# EAGLE schematic Trainiiii_Cape (EAGLE 9.6.0)

## Sheet 1 of 4
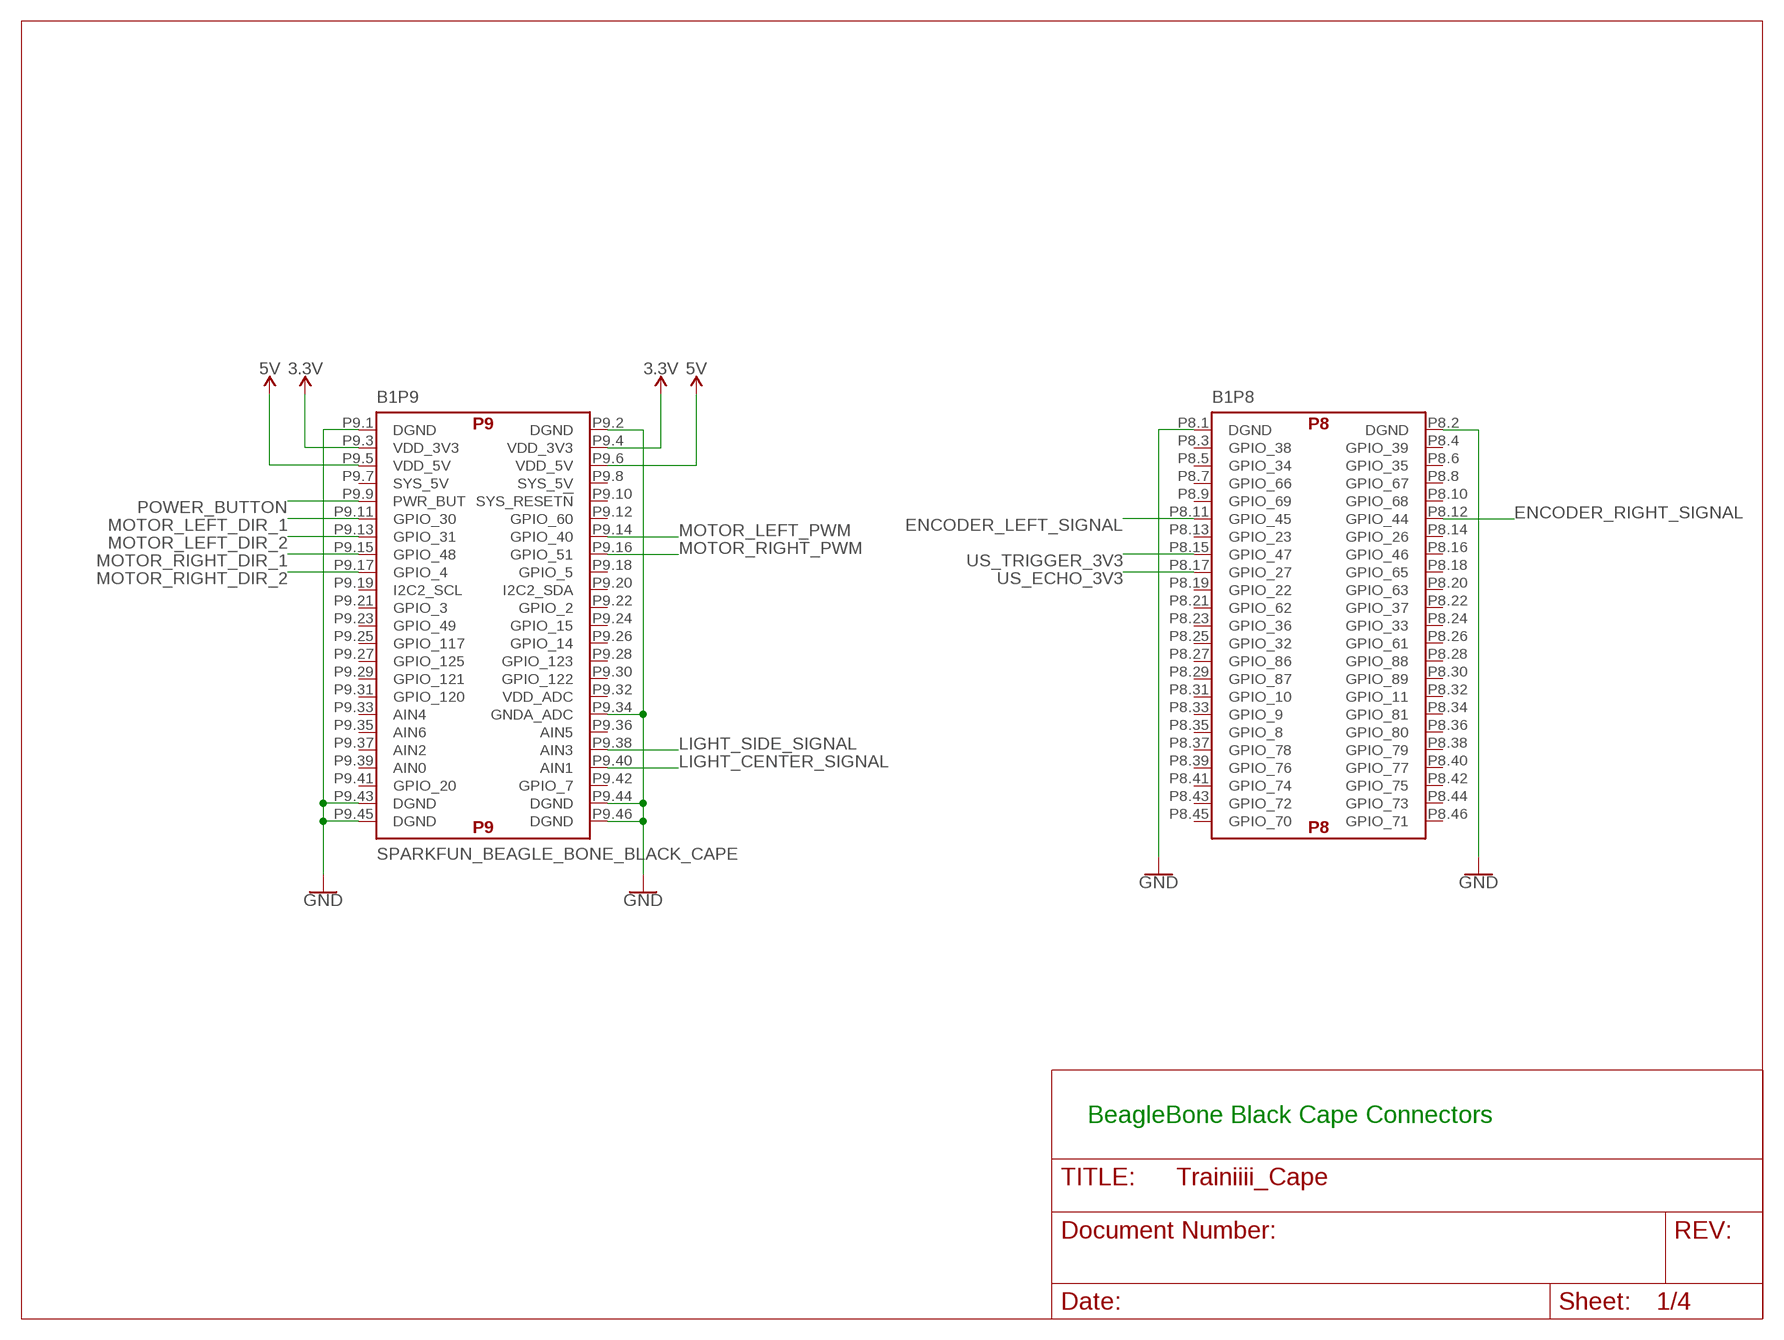
[diagram p0: schematic, sheet 1]

### Parts
B1  SPARKFUN_BEAGLE_BONE_BLACK_CAPE  [BEAGLE_BONE_BLACK_CAPE]

### Nets
3.3V: B1.P9.3(P9:VDD_3V3) B1.P9.4(P9:VDD_3V3) ; also sheet 2,3
5V: B1.P9.5(P9:VDD_5V) B1.P9.6(P9:VDD_5V) ; also sheet 3
ENCODER_LEFT_SIGNAL: B1.P8.11(P8:GPIO_45) ; also sheet 3
ENCODER_RIGHT_SIGNAL: B1.P8.12(P8:GPIO_44) ; also sheet 3
GND: B1.P8.1(P8:DGND) B1.P8.2(P8:DGND) B1.P9.1(P9:DGND) B1.P9.2(P9:DGND) B1.P9.34(P9:GNDA_ADC) B1.P9.43(P9:DGND) B1.P9.44(P9:DGND) B1.P9.45(P9:DGND) B1.P9.46(P9:DGND) ; also sheet 2,3,4
LIGHT_CENTER_SIGNAL: B1.P9.40(P9:AIN1) ; also sheet 3
LIGHT_SIDE_SIGNAL: B1.P9.38(P9:AIN3) ; also sheet 3
MOTOR_LEFT_DIR_1: B1.P9.11(P9:GPIO_30) ; also sheet 2
MOTOR_LEFT_DIR_2: B1.P9.13(P9:GPIO_31) ; also sheet 2
MOTOR_LEFT_PWM: B1.P9.14(P9:GPIO_40) ; also sheet 2
MOTOR_RIGHT_DIR_1: B1.P9.15(P9:GPIO_48) ; also sheet 2
MOTOR_RIGHT_DIR_2: B1.P9.17(P9:GPIO_4) ; also sheet 2
MOTOR_RIGHT_PWM: B1.P9.16(P9:GPIO_51) ; also sheet 2
POWER_BUTTON: B1.P9.9(P9:PWR_BUT) ; also sheet 4
US_ECHO_3V3: B1.P8.17(P8:GPIO_27) ; also sheet 3
US_TRIGGER_3V3: B1.P8.15(P8:GPIO_47) ; also sheet 3
Unconnected: B1.P8.3(P8:GPIO_38) B1.P8.4(P8:GPIO_39) B1.P8.5(P8:GPIO_34) B1.P8.6(P8:GPIO_35) B1.P8.7(P8:GPIO_66) B1.P8.8(P8:GPIO_67) B1.P8.9(P8:GPIO_69) B1.P8.10(P8:GPIO_68) B1.P8.13(P8:GPIO_23) B1.P8.14(P8:GPIO_26) B1.P8.16(P8:GPIO_46) B1.P8.18(P8:GPIO_65) B1.P8.19(P8:GPIO_22) B1.P8.20(P8:GPIO_63) B1.P8.21(P8:GPIO_62) B1.P8.22(P8:GPIO_37) B1.P8.23(P8:GPIO_36) B1.P8.24(P8:GPIO_33) B1.P8.25(P8:GPIO_32) B1.P8.26(P8:GPIO_61) B1.P8.27(P8:GPIO_86) B1.P8.28(P8:GPIO_88) B1.P8.29(P8:GPIO_87) B1.P8.30(P8:GPIO_89) B1.P8.31(P8:GPIO_10) B1.P8.32(P8:GPIO_11) B1.P8.33(P8:GPIO_9) B1.P8.34(P8:GPIO_81) B1.P8.35(P8:GPIO_8) B1.P8.36(P8:GPIO_80) B1.P8.37(P8:GPIO_78) B1.P8.38(P8:GPIO_79) B1.P8.39(P8:GPIO_76) B1.P8.40(P8:GPIO_77) B1.P8.41(P8:GPIO_74) B1.P8.42(P8:GPIO_75) B1.P8.43(P8:GPIO_72) B1.P8.44(P8:GPIO_73) B1.P8.45(P8:GPIO_70) B1.P8.46(P8:GPIO_71) B1.P9.7(P9:SYS_5V) B1.P9.8(P9:SYS_5V) B1.P9.10(P9:SYS_RESET!N) B1.P9.12(P9:GPIO_60) B1.P9.18(P9:GPIO_5) B1.P9.19(P9:I2C2_SCL) B1.P9.20(P9:I2C2_SDA) B1.P9.21(P9:GPIO_3) B1.P9.22(P9:GPIO_2) B1.P9.23(P9:GPIO_49) B1.P9.24(P9:GPIO_15) B1.P9.25(P9:GPIO_117) B1.P9.26(P9:GPIO_14) B1.P9.27(P9:GPIO_125) B1.P9.28(P9:GPIO_123) B1.P9.29(P9:GPIO_121) B1.P9.30(P9:GPIO_122) B1.P9.31(P9:GPIO_120) B1.P9.32(P9:VDD_ADC) B1.P9.33(P9:AIN4) B1.P9.35(P9:AIN6) B1.P9.36(P9:AIN5) B1.P9.37(P9:AIN2) B1.P9.39(P9:AIN0) B1.P9.41(P9:GPIO_20) B1.P9.42(P9:GPIO_7)

### Notes on the sheet
- BeagleBone Black Cape Connectors

## Sheet 2 of 4
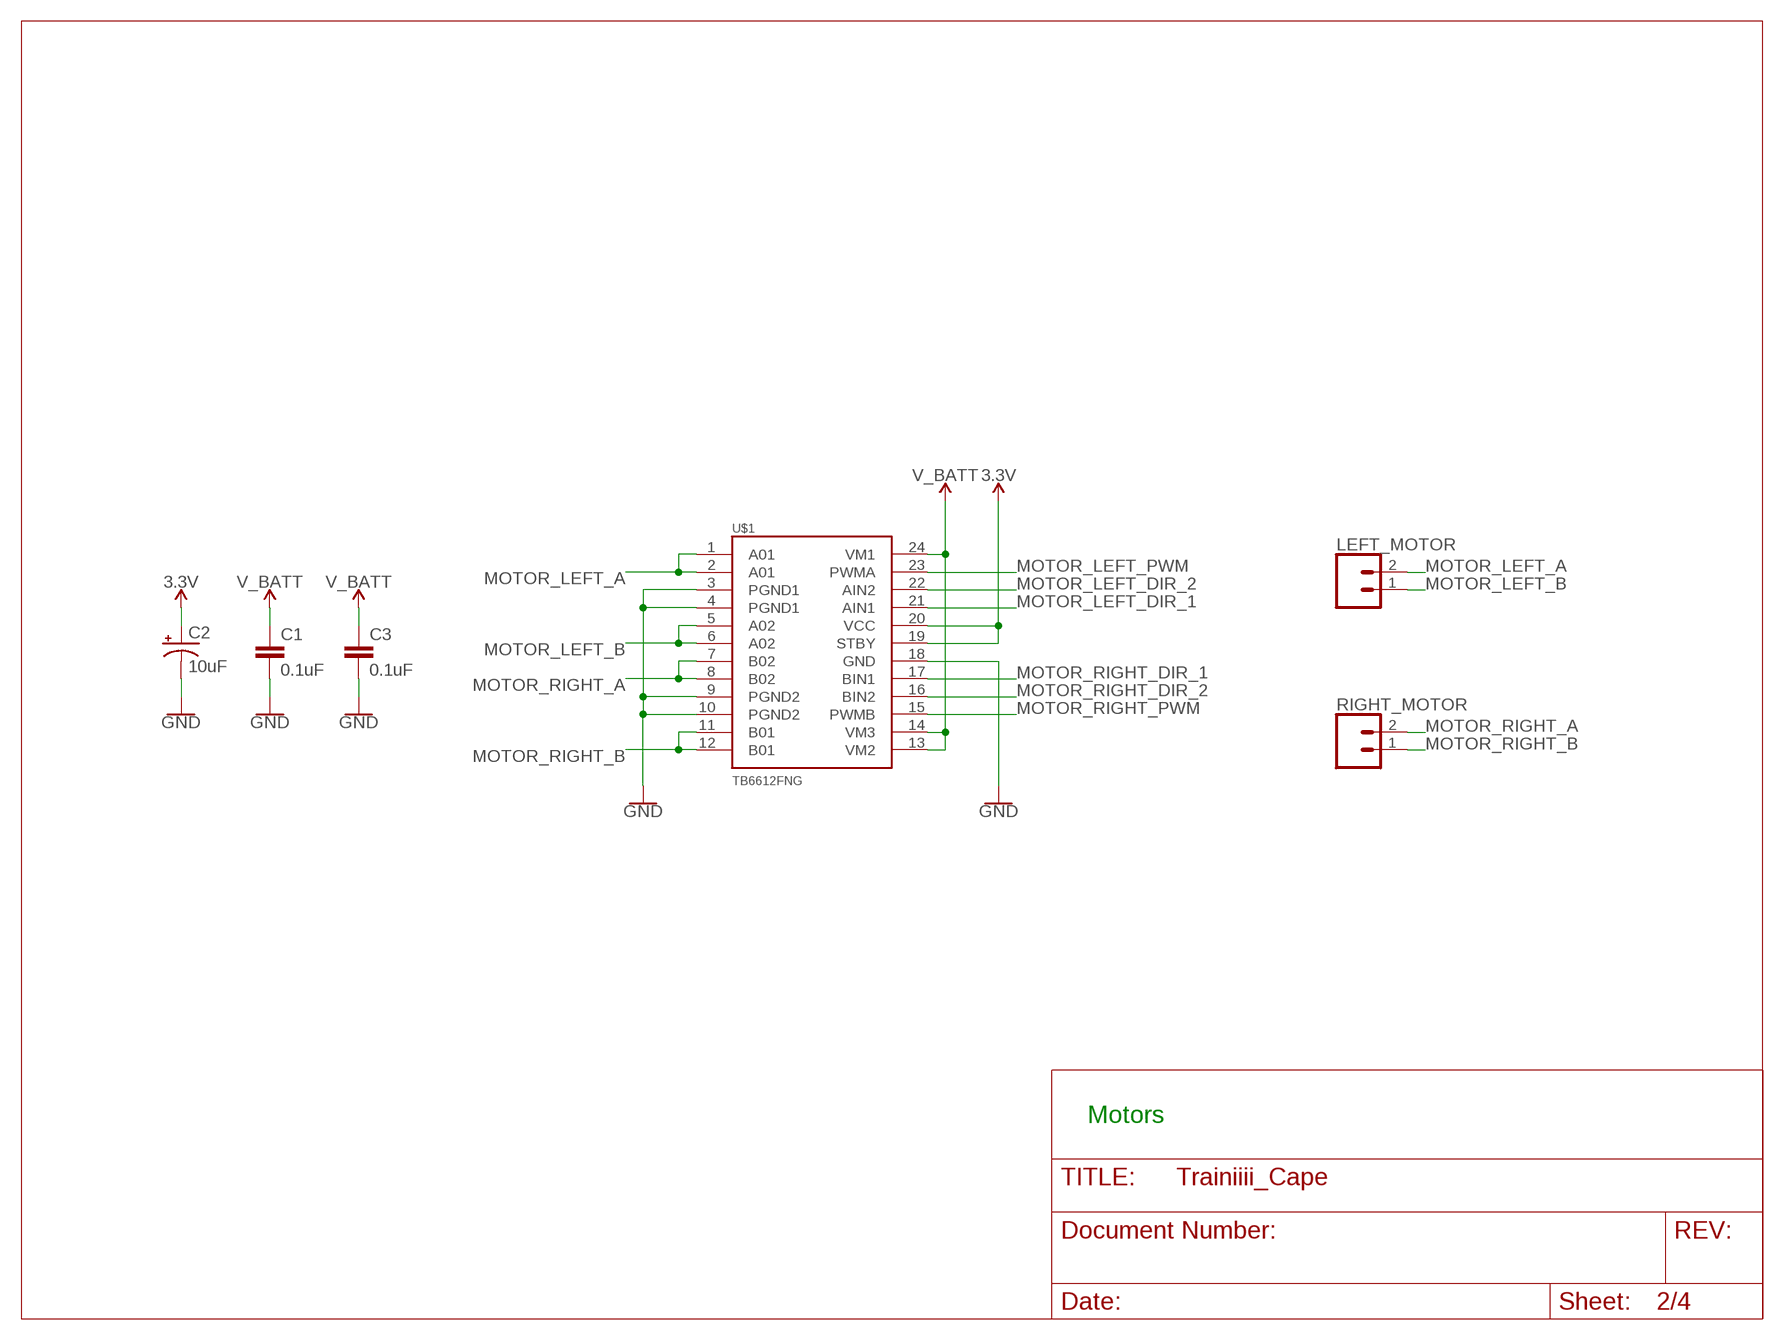
[diagram p1: schematic, sheet 2]

### Parts
C1  0.1uF  0.1UF-0402-16V-10%  [0402]
C2  10uF  10UF-POLAR-EIA3528-20V-10%(TANT)  [EIA3528]
C3  0.1uF  0.1UF-0402-16V-10%  [0402]
LEFT_MOTOR  CONN_02  [1X02]
RIGHT_MOTOR  CONN_02  [1X02]
U$1  TB6612FNG  [SSOP24]

### Nets
3.3V: C2.A(+) U$1.19(STBY) U$1.20(VCC) ; also sheet 1,3
GND: C1.2 C2.C(-) C3.2 U$1.3(PGND1) U$1.4(PGND1) U$1.9(PGND2) U$1.10(PGND2) U$1.18(GND) ; also sheet 1,3,4
MOTOR_LEFT_A: LEFT_MOTOR.2 U$1.1(A01) U$1.2(A01)
MOTOR_LEFT_B: LEFT_MOTOR.1 U$1.5(A02) U$1.6(A02)
MOTOR_LEFT_DIR_1: U$1.21(AIN1) ; also sheet 1
MOTOR_LEFT_DIR_2: U$1.22(AIN2) ; also sheet 1
MOTOR_LEFT_PWM: U$1.23(PWMA) ; also sheet 1
MOTOR_RIGHT_A: RIGHT_MOTOR.2 U$1.7(B02) U$1.8(B02)
MOTOR_RIGHT_B: RIGHT_MOTOR.1 U$1.11(B01) U$1.12(B01)
MOTOR_RIGHT_DIR_1: U$1.17(BIN1) ; also sheet 1
MOTOR_RIGHT_DIR_2: U$1.16(BIN2) ; also sheet 1
MOTOR_RIGHT_PWM: U$1.15(PWMB) ; also sheet 1
V_BATT: C1.1 C3.1 U$1.13(VM2) U$1.14(VM3) U$1.24(VM1) ; also sheet 4

### Notes on the sheet
- Motors

## Sheet 3 of 4
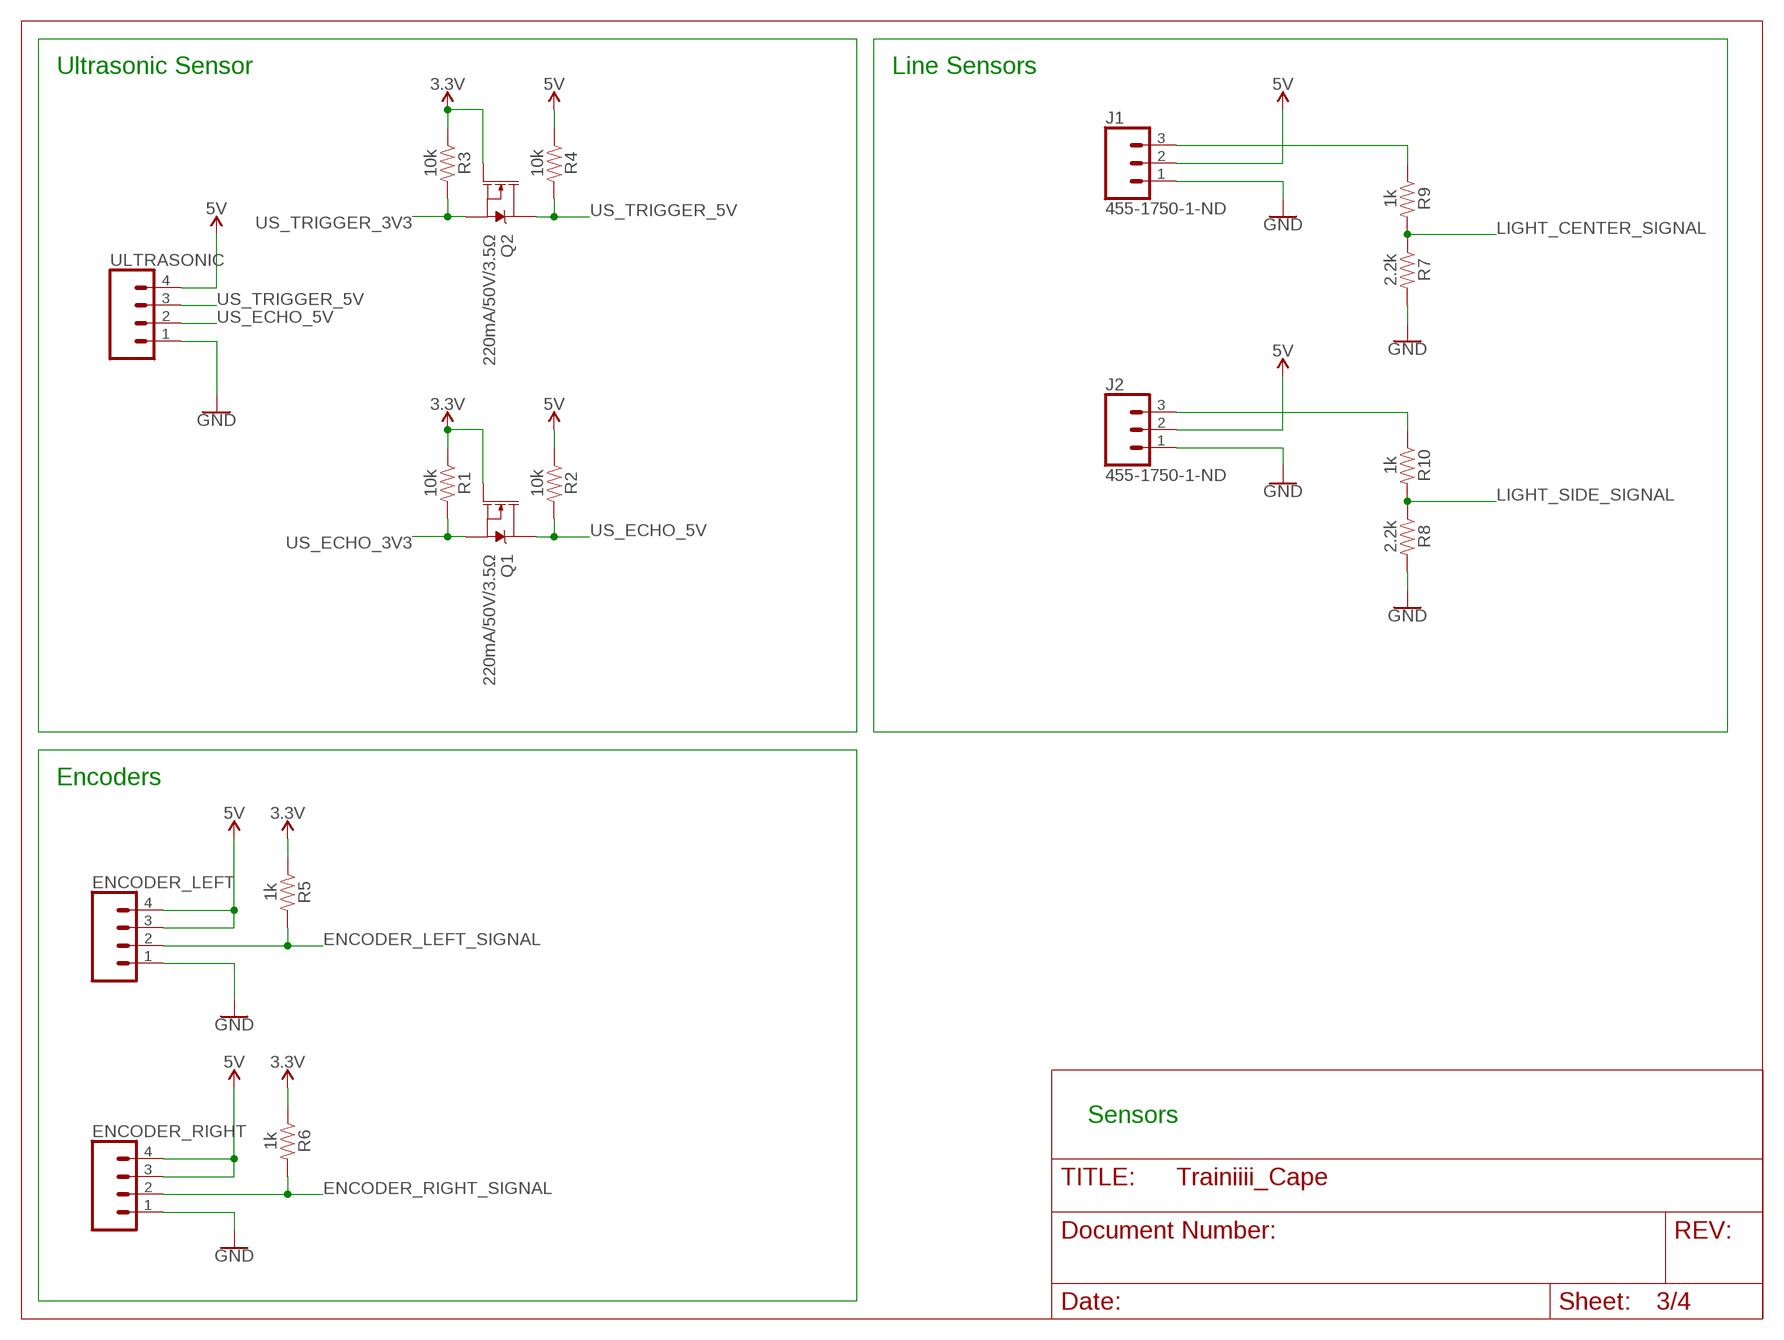
[diagram p2: schematic, sheet 3]

### Parts
ENCODER_LEFT  CONN_04PTH  [1X04]
ENCODER_RIGHT  CONN_04PTH  [1X04]
J1  455-1750-1-ND  CONN_03  [1X03]
J2  455-1750-1-ND  CONN_03  [1X03]
Q1  220mA/50V/3.5Ω  MOSFET-NCH-BSS138  [SOT23-3]
Q2  220mA/50V/3.5Ω  MOSFET-NCH-BSS138  [SOT23-3]
R1  10k  10KOHM-0603-1/10W-1%  [0603]
R2  10k  10KOHM-0603-1/10W-1%  [0603]
R3  10k  10KOHM-0603-1/10W-1%  [0603]
R4  10k  10KOHM-0603-1/10W-1%  [0603]
R5  1k  1KOHM-0603-1/10W-1%  [0603]
R6  1k  1KOHM-0603-1/10W-1%  [0603]
R7  2.2k  2.2KOHM-0603-1/10W-1%  [0603]
R8  2.2k  2.2KOHM-0603-1/10W-1%  [0603]
R9  1k  1KOHM-0603-1/10W-1%  [0603]
R10  1k  1KOHM-0603-1/10W-1%  [0603]
ULTRASONIC  CONN_04PTH  [1X04]

### Nets
3.3V: Q1.1(G) Q2.1(G) R1.1 R3.1 R5.1 R6.1 ; also sheet 1,2
5V: ENCODER_LEFT.3 ENCODER_LEFT.4 ENCODER_RIGHT.3 ENCODER_RIGHT.4 J1.2 J2.2 R2.1 R4.1 ULTRASONIC.4 ; also sheet 1
ENCODER_LEFT_SIGNAL: ENCODER_LEFT.2 R5.2 ; also sheet 1
ENCODER_RIGHT_SIGNAL: ENCODER_RIGHT.2 R6.2 ; also sheet 1
GND: ENCODER_LEFT.1 ENCODER_RIGHT.1 J1.1 J2.1 R7.2 R8.2 ULTRASONIC.1 ; also sheet 1,2,4
LIGHT_CENTER_SIGNAL: R7.1 R9.2 ; also sheet 1
LIGHT_SIDE_SIGNAL: R8.1 R10.2 ; also sheet 1
N$7: J2.3 R10.1
N$8: J1.3 R9.1
US_ECHO_3V3: Q1.2(S) R1.2 ; also sheet 1
US_ECHO_5V: Q1.3(D) R2.2 ULTRASONIC.2
US_TRIGGER_3V3: Q2.2(S) R3.2 ; also sheet 1
US_TRIGGER_5V: Q2.3(D) R4.2 ULTRASONIC.3

### Notes on the sheet
- Ultrasonic Sensor | Line Sensors
- Encoders
- Sensors

## Sheet 4 of 4
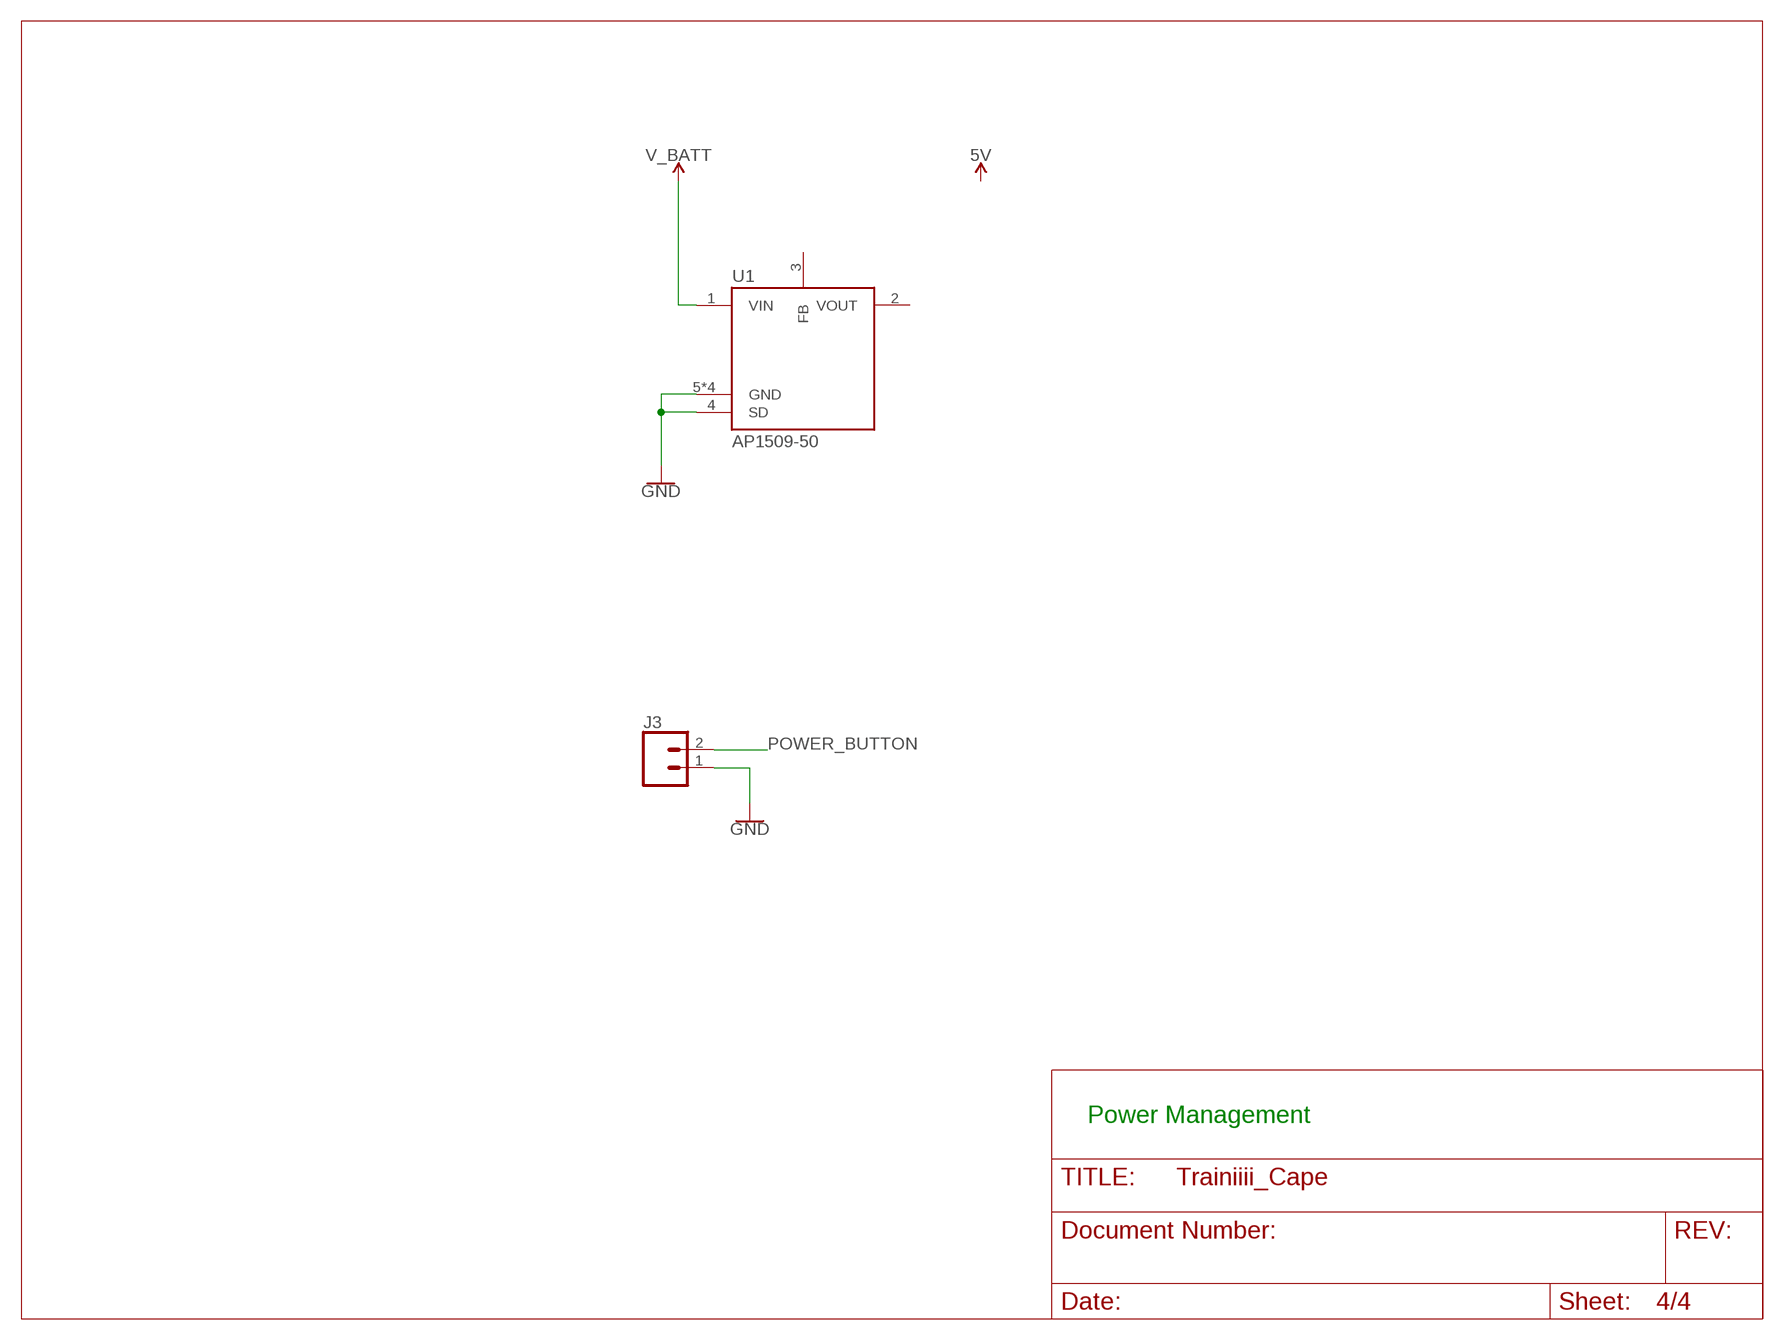
[diagram p3: schematic, sheet 4]

### Parts
J3  CONN_02  [1X02]
U1  AP1509-50  [SOIC-8]

### Nets
GND: J3.1 U1.4(SD) U1.5(GND) U1.6(GND) U1.7(GND) U1.8(GND) ; also sheet 1,2,3
POWER_BUTTON: J3.2 ; also sheet 1
V_BATT: U1.1(VIN) ; also sheet 2
Unconnected: U1.2(VOUT) U1.3(FB)

### Notes on the sheet
- Power Management

## Library data of the parts
B1 = SparkFun-Boards:SPARKFUN_BEAGLE_BONE_BLACK_CAPE: BeagleBone Black Rev C Cape Generic footprint for BeagleBone Black Rev C Capes. SparkFun Products: SparkFun BeagleBone Black Proto Cape <https://www.sparkfun.com/products/12774> SparkFun CryptoCape <https://www.sparkfun.com/products/12773>
C1 C3 = SparkFun-Capacitors:0.1UF: 0.1µF ceramic capacitors A capacitor is a passive two-terminal electrical component used to store electrical energy temporarily in an electric field.; PROD_ID: CAP-12416
C2 = SparkFun-Capacitors:10UF-POLAR: 10.0µF polarized capacitors A capacitor is a passive two-terminal electrical component used to store electrical energy temporarily in an electric field.; PROD_ID: CAP-08063
ENCODER_LEFT ENCODER_RIGHT ULTRASONIC = SparkFun-Connectors:CONN_04: Multi connection point. Often used as Generic Header-pin footprint for 0.1 inch spaced/style header connections On any of the 0.1 inch spaced packages, you can populate with these: Break Away Headers - Straight <https://www.sparkfun.com/products/116> (PRT-00116) Break Away Male Headers - Right Angle <https://www.sparkfun.com/products/553> (PRT-00553) Female Headers <https://www.sparkfun.com/products/115> (PRT-00115) Break Away Headers - Machine Pin <https://www.sparkfun.com/products/117> (PRT-00117) Break Away Female Headers - Swiss Machine Pin <https://www.sparkfun.com/products/743> (PRT-00743) For SCREWTERMINALS and SPRING TERMINALS visit here: Screw Terimnals on SparkFun.com <https://www.sparkfun.com/search/results?term=Screw+Terminals> (5mm/3.5mm/2.54mm spacing) This device is also useful as a general connection point to wire up your design to another part of your project. Our various solder wires solder well into these plated through hole pads. Hook-Up Wire - Assortment (Stranded, 22 AWG) <https://www.sparkfun.com/products/11375> (PRT-11375) Hook-Up Wire - Assortment (Solid Core, 22 AWG) <https://www.sparkfun.com/products/11367> (PRT-11367) View the entire wire category on our website here <https://www.sparkfun.com/categories/141> Special notes: Molex polarized connector foot print use with SKU : PRT-08231 with associated crimp pins and housings. 1MM SMD Version SKU: PRT-10208; PROD_ID: CONN-09696
J1 J2 = SparkFun-Connectors:CONN_03: Multi connection point. Often used as Generic Header-pin footprint for 0.1 inch spaced/style header connections On any of the 0.1 inch spaced packages, you can populate with these: Break Away Headers - Straight <https://www.sparkfun.com/products/116> (PRT-00116) Break Away Male Headers - Right Angle <https://www.sparkfun.com/products/553> (PRT-00553) Female Headers <https://www.sparkfun.com/products/115> (PRT-00115) Break Away Headers - Machine Pin <https://www.sparkfun.com/products/117> (PRT-00117) Break Away Female Headers - Swiss Machine Pin <https://www.sparkfun.com/products/743> (PRT-00743) Stackable Header - 3 Pin (Female, 0.1") <https://www.sparkfun.com/products/13875> (PRT-13875) For SCREWTERMINALS and SPRING TERMINALS visit here: Screw Terimnals on SparkFun.com <https://www.sparkfun.com/search/results?term=Screw+Terminals> (5mm/3.5mm/2.54mm spacing) This device is also useful as a general connection point to wire up your design to another part of your project. Our various solder wires solder well into these plated through hole pads. Hook-Up Wire - Assortment (Stranded, 22 AWG) <https://www.sparkfun.com/products/11375> (PRT-11375) Hook-Up Wire - Assortment (Solid Core, 22 AWG) <https://www.sparkfun.com/products/11367> (PRT-11367) View the entire wire category on our website here <https://www.sparkfun.com/categories/141> Special notes: Molex polarized connector foot print use with SKU : PRT-08232 with associated crimp pins and housings.; PROD_ID: XXX-00000
J3 LEFT_MOTOR RIGHT_MOTOR = SparkFun-Connectors:CONN_02: Multi connection point. Often used as Generic Header-pin footprint for 0.1 inch spaced/style header connections On any of the 0.1 inch spaced packages, you can populate with these: Break Away Headers - Straight <https://www.sparkfun.com/products/116> (PRT-00116) Break Away Male Headers - Right Angle <https://www.sparkfun.com/products/553> (PRT-00553) Female Headers <https://www.sparkfun.com/products/115> (PRT-00115) Break Away Headers - Machine Pin <https://www.sparkfun.com/products/117> (PRT-00117) Break Away Female Headers - Swiss Machine Pin <https://www.sparkfun.com/products/743> (PRT-00743) For SCREWTERMINALS and SPRING TERMINALS visit here: Screw Terimnals on SparkFun.com <https://www.sparkfun.com/search/results?term=Screw+Terminals> (5mm/3.5mm/2.54mm spacing) This device is also useful as a general connection point to wire up your design to another part of your project. Our various solder wires solder well into these plated through hole pads. Hook-Up Wire - Assortment (Stranded, 22 AWG) <https://www.sparkfun.com/products/11375> (PRT-11375) Hook-Up Wire - Assortment (Solid Core, 22 AWG) <https://www.sparkfun.com/products/11367> (PRT-11367) View the entire wire category on our website here <https://www.sparkfun.com/categories/141> Special notes: Molex polarized connector foot print use with: PRT-08233 with associated crimp pins and housings. 2.54_SCREWTERM for use with PRT-10571. 3.5mm Screw Terminal footprints for PRT-08084 5mm Screw Terminal footprints for use with PRT-08432
Q1 Q2 = SparkFun-DiscreteSemi:MOSFET-NCH: N-channel MOSFETs Voltage controlled devices that allow control of high current outputs. SparkFun Products: SparkFun OpenScale <https://www.sparkfun.com/products/13261> SparkFun Digital Sandbox <https://www.sparkfun.com/products/12651> SparkFun Monster Moto Shield <https://www.sparkfun.com/products/10182> SparkFun MOSFET Power Controller <https://www.sparkfun.com/products/11214>; PROD_ID: TRANS-00830
R1-R4 = SparkFun-Resistors:10KOHM: 10kΩ resistor A resistor is a passive two-terminal electrical component that implements electrical resistance as a circuit element. Resistors act to reduce current flow, and, at the same time, act to lower voltage levels within circuits. - Wikipedia; PROD_ID: RES-00824
R5 R6 R9 R10 = SparkFun-Resistors:1KOHM: 1kΩ resistor A resistor is a passive two-terminal electrical component that implements electrical resistance as a circuit element. Resistors act to reduce current flow, and, at the same time, act to lower voltage levels within circuits. - Wikipedia; PROD_ID: RES-07856
R7 R8 = SparkFun-Resistors:2.2KOHM: 2.2kΩ resistor A resistor is a passive two-terminal electrical component that implements electrical resistance as a circuit element. Resistors act to reduce current flow, and, at the same time, act to lower voltage levels within circuits. - Wikipedia; PROD_ID: RES-08272
U1 = RoboJackets-PowerICs:AP1509-50
U$1 = SparkFun-IC-Special-Function:TB6612FNG: Toshiba 1A dual motor driver IC-09363; PROD_ID: IC-09363